# Altium project DCDC.PrjPcb (part 4 of 9)

## Sheet ISO_IO.SchDoc
size A3 portrait; SheetNumber: 3; SheetTotal: 8
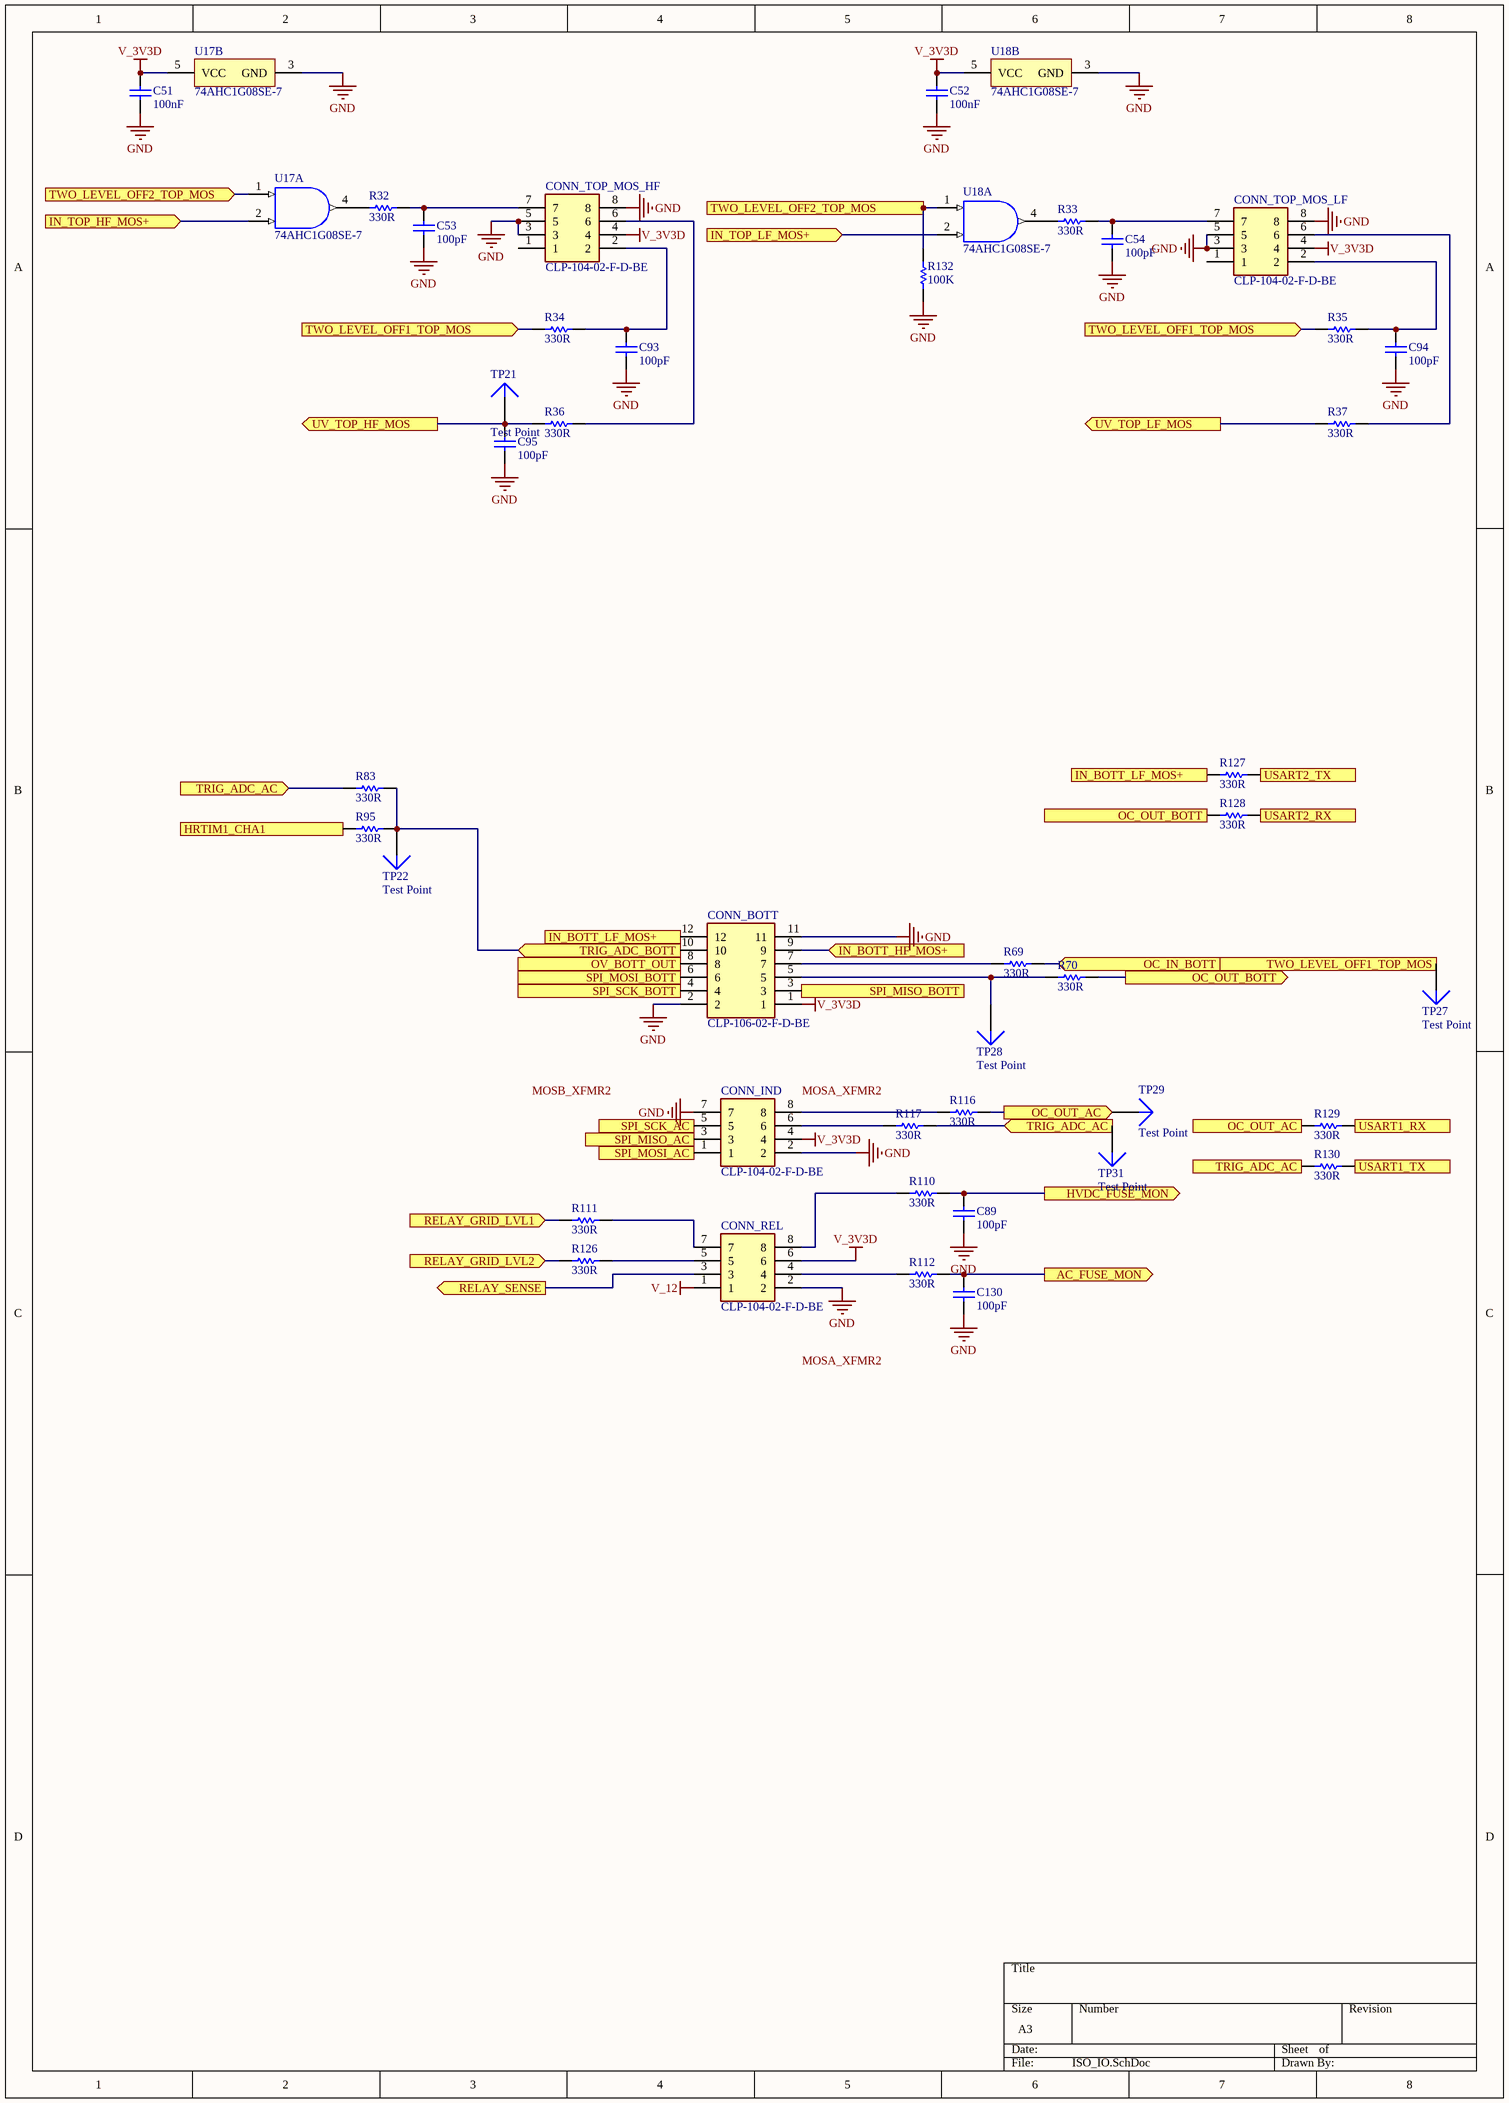
[diagram p3: ISO_IO.SchDoc]

### Parts
C51  100nF  [CAPC1608X90X35NL10T15]
C52  100nF  [CAPC1608X90X35NL10T15]
C53  100pF  [CAPC1608X90X35NL10T15]
C54  100pF  [CAPC1608X90X35NL10T15]
C89  100pF  [CAPC1608X90X35NL10T15]
C93  100pF  [CAPC1608X90X35NL10T15]
C94  100pF  [CAPC1608X90X35NL10T15]
C95  100pF  [CAPC1608X90X35NL10T15]
C130  100pF  [CAPC1608X90X35NL10T15]
CONN_BOTT  CLP-106-02-F-D-BE  [CLP-106-02-XXX-D-BE]
CONN_IND  CLP-104-02-F-D-BE  [CLP-104-02-XXX-D-BE]
CONN_REL  CLP-104-02-F-D-BE  [CLP-104-02-XXX-D-BE]
CONN_TOP_MOS_HF  CLP-104-02-F-D-BE  [CLP-104-02-XXX-D-BE]
CONN_TOP_MOS_LF  CLP-104-02-F-D-BE  [CLP-104-02-XXX-D-BE]
R32  330R  [RESC1608X55X25NL10T15]
R33  330R  [RESC1608X55X25NL10T15]
R34  330R  [RESC1608X55X25NL10T15]
R35  330R  [RESC1608X55X25NL10T15]
R36  330R  [RESC1608X55X25NL10T15]
R37  330R  [RESC1608X55X25NL10T15]
R69  330R  [RESC1608X55X25NL10T15]
R70  330R  [RESC1608X55X25NL10T15]
R83  330R  [RESC1608X55X25NL10T15]
R95  330R  [RESC1608X55X25NL10T15]
R110  330R  [RESC1608X55X25NL10T15]
R111  330R  [RESC1608X55X25NL10T15]
R112  330R  [RESC1608X55X25NL10T15]
R116  330R  [RESC1608X55X25NL10T15]
R117  330R  [RESC1608X55X25NL10T15]
R126  330R  [RESC1608X55X25NL10T15]
R127  330R  [RESC1608X55X25NL10T15]
R128  330R  [RESC1608X55X25NL10T15]
R129  330R  [RESC1608X55X25NL10T15]
R130  330R  [RESC1608X55X25NL10T15]
R132  100K  [RESC1608X55X25NL10T15]
TP21  Test Point  [TP1.5mm]
TP22  Test Point  [TP1.5mm]
TP27  Test Point  [TP1.5mm]
TP28  Test Point  [TP1.5mm]
TP29  Test Point  [TP1.5mm]
TP31  Test Point  [TP1.5mm]
U17  74AHC1G08SE-7  [DCK0005A_M]  (parts A,B of 2)
U18  74AHC1G08SE-7  [DCK0005A_M]  (parts A,B of 2)

### Ports
AC_FUSE_MON (out), HRTIM1_CHA1 (in), HVDC_FUSE_MON (out), IN_BOTT_HF_MOS+ (in), IN_BOTT_LF_MOS+ (in), IN_BOTT_LF_MOS+ (out), IN_TOP_HF_MOS+ (in), IN_TOP_LF_MOS+ (in), OC_IN_BOTT (in), OC_OUT_AC (in), OC_OUT_AC (out), OC_OUT_BOTT (in), OC_OUT_BOTT (out), OV_BOTT_OUT (out), RELAY_GRID_LVL1 (in), RELAY_GRID_LVL2 (in), RELAY_SENSE (out), SPI_MISO_AC (in), SPI_MISO_BOTT (in), SPI_MOSI_AC (out), SPI_MOSI_BOTT (out), SPI_SCK_AC (out), SPI_SCK_BOTT (out), TRIG_ADC_AC (in), TRIG_ADC_AC (out), TRIG_ADC_BOTT (in), TWO_LEVEL_OFF1_TOP_MOS (in), TWO_LEVEL_OFF1_TOP_MOS (out), TWO_LEVEL_OFF2_TOP_MOS (in), USART1_RX (out), USART1_TX (in), USART2_RX (out), USART2_TX (in), UV_TOP_HF_MOS (out), UV_TOP_LF_MOS (out)

### Nets
GND: C51.1 C52.1 C53.1 C54.1 C89.1 C93.1 C94.1 C95.1 C130.1 CONN_BOTT.2 CONN_BOTT.11 CONN_IND.2 CONN_IND.7 CONN_REL.2 CONN_TOP_MOS_HF.3 CONN_TOP_MOS_HF.5 CONN_TOP_MOS_HF.8 CONN_TOP_MOS_LF.3 CONN_TOP_MOS_LF.5 CONN_TOP_MOS_LF.8 R132.1 U17.3(GND) U18.3(GND)
V_3V3D: C51.2 C52.2 CONN_BOTT.1 CONN_IND.4 CONN_REL.6 CONN_TOP_MOS_HF.4 CONN_TOP_MOS_LF.4 U17.5(VCC) U18.5(VCC)
V_12: CONN_REL.1
HRTIM1_CHA1: R95.1 ; port HRTIM1_CHA1
HRTIM1_CHE2: R83.1 R117.2 R130.1 TP31.1 ; port TRIG_ADC_AC
HRTIM1_CHF1: U17.2(B) ; port IN_TOP_HF_MOS+
HRTIM1_CHF2: CONN_BOTT.9 ; port IN_BOTT_HF_MOS+
USART2_RX_STM32: R128.2 ; port USART2_RX
USART2_TX_STM32: R127.2 ; port USART2_TX
NetC53_2: C53.2 CONN_TOP_MOS_HF.7 R32.2
NetC54_2: C54.2 CONN_TOP_MOS_LF.7 R33.2
NetC89_2: C89.2 R110.1 ; port HVDC_FUSE_MON
NetC93_2: C93.2 CONN_TOP_MOS_HF.2 R34.2
NetC94_2: C94.2 CONN_TOP_MOS_LF.2 R35.2
NetC95_2: C95.2 R36.1 R37.1 TP21.1 ; port UV_TOP_LF_MOS, port UV_TOP_HF_MOS
NetC130_2: C130.2 R112.1 ; port AC_FUSE_MON
NetCONN_BOTT_3: CONN_BOTT.3 ; port SPI_MISO_BOTT
NetCONN_BOTT_4: CONN_BOTT.4 ; port SPI_SCK_BOTT
NetCONN_BOTT_5: CONN_BOTT.5 R70.1 TP28.1
NetCONN_BOTT_6: CONN_BOTT.6 ; port SPI_MOSI_BOTT
NetCONN_BOTT_7: CONN_BOTT.7 R69.1
NetCONN_BOTT_8: CONN_BOTT.8 ; port OV_BOTT_OUT
NetCONN_BOTT_10: CONN_BOTT.10 R83.2 R95.2 TP22.1 ; port TRIG_ADC_BOTT
NetCONN_BOTT_12: CONN_BOTT.12 R127.1 ; port IN_BOTT_LF_MOS+
NetCONN_IND_1: CONN_IND.1 ; port SPI_MOSI_AC
NetCONN_IND_3: CONN_IND.3 ; port SPI_MISO_AC
NetCONN_IND_5: CONN_IND.5 ; port SPI_SCK_AC
NetCONN_IND_6: CONN_IND.6 R117.1
NetCONN_IND_8: CONN_IND.8 R116.1
NetCONN_REL_3: CONN_REL.3 ; port RELAY_SENSE
NetCONN_REL_4: CONN_REL.4 R112.2
NetCONN_REL_5: CONN_REL.5 R126.2
NetCONN_REL_7: CONN_REL.7 R111.1
NetCONN_REL_8: CONN_REL.8 R110.2
NetCONN_TOP_MOS_HF_6: CONN_TOP_MOS_HF.6 R36.2
NetCONN_TOP_MOS_LF_6: CONN_TOP_MOS_LF.6 R37.2
NetR32_1: R32.1 U17.4(Y)
NetR33_1: R33.1 U18.4(Y)
NetR34_1: R34.1 R35.1 R69.2 TP27.1 ; port TWO_LEVEL_OFF1_TOP_MOS, port OC_IN_BOTT
NetR70_2: R70.2 R128.1 ; port OC_OUT_BOTT
NetR111_2: R111.2 ; port RELAY_GRID_LVL1
NetR116_2: R116.2 R129.1 TP29.1 ; port OC_OUT_AC
NetR125_1: R132.2 U17.1(A) U18.1(A) ; port TWO_LEVEL_OFF2_TOP_MOS
NetR126_1: R126.1 ; port RELAY_GRID_LVL2
NetR129_2: R129.2 ; port USART1_RX
NetR130_2: R130.2 ; port USART1_TX
NetU1_2: U18.2(B) ; port IN_TOP_LF_MOS+

Not connected (* = marked no-connect by the designer): CONN_TOP_MOS_HF 1; CONN_TOP_MOS_LF 1

### Notes on the sheet
- Labels drawn without touching a wire or pin: MOSA_XFMR2, MOSB_XFMR2

### Library data of the parts
C51 C52 = CAP: X7R 100nF ±10% 50V 0603 Multilayer Ceramic Capacitors MLCC - SMD/SMT ROHS; Part Number: GCM188R72A104KA64D; Manufacturer: Murata; Manufacturer Part Number: CC0603KRX7R9BB104; Voltage Rating: 100V; Supplier 1: Arrow Electronics; Supplier Part Number 1: GCM188R72A104KA64D; RoHS: Yes; Category: Ceramic Capacitors; Mount: Surface Mount; Case/Package: 0603; Case Code (Imperial): 0603; Case Code (Metric): 1608; Min Operating Temperature: -55°C; Max Operating Temperature: 125°C; Tolerance: 10%; Packaging: Tape and Reel; Capacitance: 100nF; Dielectric: X7R; Termination: SMD/SMT; Voltage Rating (DC): 100V; Length: 1.6mm; Height: 0.8mm; Depth: 0.8mm; Radiation Hardening: No; ComponentLink1URL: https://datasheet.ciiva.com/17451/product-17451047.pdf?src-supplier=Avnet+Europe; ComponentLink1Description: https://datasheet.ciiva.com/17451/product-17451047.pdf?src-supplier=Avnet+Europe; ComponentLink2URL: https://datasheet.ciiva.com/26889/getdatasheetpartid-387765-26889164.pdf?src-supplier=Verical; ComponentLink2Description: https://datasheet.ciiva.com/26889/getdatasheetpartid-387765-26889164.pdf?src-supplier=Verical; Parameter 1: *; JLCPCB Part #: C14663
C53 C54 C89 C93-C95 C130 = CMP-2006-02595-1: C0G ±5% 50V 100pF 0603 Multilayer Ceramic Capacitors MLCC - SMD/SMT ROHS; Part Number: GRM1885C1H101JA01D; Manufacturer: Murata; Temperature Coefficient: 30ppm/°C; Insulation Resistance: 10GR; Supplier 1: Digi-Key; Supplier Part Number 1: 490-1427-1-ND; Manufacturer Part Number: GRM1885C1H101JA01D; RoHS: Yes; Category: Ceramic Capacitors; Stock 1: 98306; Pricing 1: 1=0.10000, 10=0.06100, 50=0.03320, 100=0.02700, 500=0.01932, 1000=0.01518 (USD); Mount: Surface Mount; Case/Package: 0603; Number of Pins: 2; Case Code (Metric): 1608; Case Code (Imperial): 0603; Dielectric Material: Ceramic; Weight: 7.1E-05oz; Material: Ceramic; Min Operating Temperature: -55°C; Max Operating Temperature: 125°C; Capacitance: 100pF; Voltage Rating: 50V; Tolerance: 5%; Packaging: Tape and Reel; Package Quantity: 1; Voltage Rating (DC): 50V; Dielectric: C0G; Termination: SMD/SMT; Voltage: 50V; Length: 1.6mm; Width: 0.031inch; Height: 0.8mm; Thickness: 0.035inch; Depth: 0.8mm; Radiation Hardening: No; RoHS Compliant: Yes; REACH SVHC: Unknown; Lead Free: Lead Free; ComponentLink1URL: https://datasheet.ciiva.com/131/product-131088.pdf?src-supplier=Digi-Key; ComponentLink1Description: https://datasheet.ciiva.com/131/product-131088.pdf?src-supplier=Digi-Key; ComponentLink2URL: https://datasheet.ciiva.com/18100/getdatasheetpartid-26823-18100641.pdf?src-supplier=Verical; ComponentLink2Description: https://datasheet.ciiva.com/18100/getdatasheetpartid-26823-18100641.pdf?src-supplier=Verical; ComponentLink3URL: https://datasheet.ciiva.com/3777/grm1885c1h101ja0123-3777264.pdf?src-supplier=Arrow+Electronics; ComponentLink3Description: https://datasheet.ciiva.com/3777/grm1885c1h101ja0123-3777264.pdf?src-supplier=Arrow+Electronics; ComponentLink4URL: https://datasheet.ciiva.com/29149/450134-da-01-en-vs-kondensator-0603-29149008.pdf?src-supplier=Conrad; ComponentLink4Description: https://datasheet.ciiva.com/29149/450134-da-01-en-vs-kondensator-0603-29149008.pdf?src-supplier=Conrad; ComponentLink5URL: https://datasheet.ciiva.com/131/partnumbering-e-01-131089.pdf?src-supplier=Digi-Key; ComponentLink5Description: https://datasheet.ciiva.com/131/partnumbering-e-01-131089.pdf?src-supplier=Digi-Key; ComponentLink6URL: https://datasheet.ciiva.com/11605/c02e-11605557.pdf?src-supplier=Avnet; ComponentLink6Description: https://datasheet.ciiva.com/11605/c02e-11605557.pdf?src-supplier=Avnet; ComponentLink7URL: https://datasheet.ciiva.com/28556/4360-28556551.pdf?src-supplier=Element14; ComponentLink7Description: https://datasheet.ciiva.com/28556/4360-28556551.pdf?src-supplier=Element14; ComponentLink8URL: https://datasheet.ciiva.com/7828/4360-7828889.pdf?src-supplier=Element14; ComponentLink8Description: https://datasheet.ciiva.com/7828/4360-7828889.pdf?src-supplier=Element14; ComponentLink9URL: https://datasheet.ciiva.com/7828/4360-7828890.pdf?src-supplier=Element14; ComponentLink9Description: https://datasheet.ciiva.com/7828/4360-7828890.pdf?src-supplier=Element14; ComponentLink10URL: https://datasheet.ciiva.com/7828/4360-7828891.pdf?src-supplier=Element14; ComponentLink10Description: https://datasheet.ciiva.com/7828/4360-7828891.pdf?src-supplier=Element14; ComponentLink11URL: https://datasheet.ciiva.com/14116/grmseries-tc-hitype-eng-14116828.pdf?src-supplier=Distrelec; ComponentLink11Description: https://datasheet.ciiva.com/14116/grmseries-tc-hitype-eng-14116828.pdf?src-supplier=Distrelec; ComponentLink12URL: https://datasheet.ciiva.com/16291/product-16291613.pdf?src-supplier=Future+Electronics; ComponentLink12Description: https://datasheet.ciiva.com/16291/product-16291613.pdf?src-supplier=Future+Electronics; ComponentLink13URL: https://datasheet.ciiva.com/131/partnumbering-e-01-131087.pdf?src-supplier=Digi-Key; ComponentLink13Description: https://datasheet.ciiva.com/131/partnumbering-e-01-131087.pdf?src-supplier=Digi-Key; ComponentLink14URL: https://datasheet.ciiva.com/14116/grmseries-tc-hitype-eng-14116815.pdf?src-supplier=Distrelec; ComponentLink14Description: https://datasheet.ciiva.com/14116/grmseries-tc-hitype-eng-14116815.pdf?src-supplier=Distrelec; Parameter 1: *; JLCPCB Part #: C14858
CONN_BOTT = CLP-106-02-F-D-BE: Connector; Manufacturer_Name: SAMTEC; Datasheet Link: http://suddendocs.samtec.com/prints/erm8-xxx-xx.x-xxx-dv-xxxx-xx-mkt.pdf; Manufacturer_Part_Number: CLP-106-02-F-D-BE; Mouser Part Number: 200-CLP10602FDBE; Mouser Price/Stock: https://www.mouser.co.uk/ProductDetail/Samtec/CLP-106-02-F-D-BE?qs=0lQeLiL1qybMRsXYGL6Lww%3D%3D; Arrow Part Number: CLP-106-02-F-D-BE; Arrow Price/Stock: https://www.arrow.com/en/products/clp-106-02-f-d-be/samtec; Parameter 1: *; JLCPCB Part #: *
CONN_IND CONN_REL CONN_TOP_MOS_HF CONN_TOP_MOS_LF = CLP-104-02-F-D-BE: Connector; Manufacturer_Name: SAMTEC; Datasheet Link: http://suddendocs.samtec.com/prints/erm8-xxx-xx.x-xxx-dv-xxxx-xx-mkt.pdf; Manufacturer_Part_Number: CLP-104-02-F-D-BE; Mouser Part Number: 200-CLP10402FDBE; Mouser Price/Stock: https://www.mouser.co.uk/ProductDetail/Samtec/CLP-104-02-F-D-BE?qs=0lQeLiL1qybJIh6Z%2F3PMbA%3D%3D; Arrow Part Number: CLP-104-02-F-D-BE; Arrow Price/Stock: https://www.arrow.com/en/products/clp-104-02-f-d-be/samtec; Parameter 1: *; JLCPCB Part #: *
R32-R37 = RES-2: ±1% 330Ω ±100ppm/℃ 0.1W 0603 Chip Resistor - Surface Mount ROHS; Tolerance: 10%; ESR: 800 mohm; Voltage Rating (DC): 16 V; Capacitance: 47 uF; Length: 7.3 mm; ComponentLink1URL: http://www.yageo.com/; Packaging: Tape and Reel; Pins: 2; ComponentLink1Description: Manufacturer URL; Case Code (Imperial): 2917; REACH SVHC: No SVHC; Width: 4.3 mm; ComponentLink2Description: Datasheet; Voltage Rating: 16 V; RoHSCompliant: True; Max Operating Temperature: 125degC; ComponentLink2URL: http://www.yageo.com/documents/recent/PYu-RC_Group_51_RoHS_L_04.pdf; Min Operating Temperature: -55degC; Case/Package: 2917; Radiation Hardening: No; DatasheetVersion: Rev. 4, 02/2016; Mount: Surface Mount; PackageReference: 0603; Package Quantity: 500; Case Code (Metric): 7343; PackageDescription: 2-Pin Surface Mount Device, Body 1.6 x 0.8 mm; Height: 3.1 mm; Parameter 1: *; JLCPCB Part #: C23138
R69 R70 R83 R95 R116 R117 R126-R130 = CMP-1659-00020-2: ±1% 330Ω ±100ppm/℃ 0.1W 0603 Chip Resistor - Surface Mount ROHS; Manufacturer: Yageo; Manufacturer Part Number: RC0603FR-07330RL; Tolerance: 10%; ESR: 800 mohm; Voltage Rating (DC): 16 V; Capacitance: 47 uF; Temperature Coefficient: 100ppm/°C; Power Rating: 100mW; Length: 7.3 mm; ComponentLink1URL: http://www.yageo.com/; Packaging: Tape and Reel; Pins: 2; ComponentLink1Description: Manufacturer URL; Case Code (Imperial): 2917; REACH SVHC: No SVHC; Width: 4.3 mm; ComponentLink2Description: Datasheet; Voltage Rating: 16 V; RoHSCompliant: True; Max Operating Temperature: 125degC; ComponentLink2URL: http://www.yageo.com/documents/recent/PYu-RC_Group_51_RoHS_L_04.pdf; Min Operating Temperature: -55degC; Case/Package: 2917; Radiation Hardening: No; DatasheetVersion: Rev. 4, 02/2016; Mount: Surface Mount; PackageReference: 0603; Package Quantity: 500; Case Code (Metric): 7343; PackageDescription: 2-Pin Surface Mount Device, Body 1.6 x 0.8 mm; Height: 3.1 mm; Supplier 1: Digi-Key; Supplier Part Number 1: 311-330HRCT-ND; RoHS: Yes; Category: Chip SMD Resistors; Stock 1: 4209654; Pricing 1: 1=0.10000, 10=0.02300, 100=0.00940, 1000=0.00421, 2500=0.00366 (USD); Number of Pins: 2; Composition: Thick Film; Resistance: 330R; Number of Terminations: 2; Max Power Dissipation: 100mW; Termination: SMD/SMT; Features: Moisture Resistant; Depth: 0.8mm; Lead Free: Lead Free; ComponentLink3URL: https://datasheet.ciiva.com/11819/0900766b80f96399-11819327.pdf?src-supplier=RSComponents; ComponentLink3Description: https://datasheet.ciiva.com/11819/0900766b80f96399-11819327.pdf?src-supplier=RSComponents; ComponentLink4URL: https://datasheet.ciiva.com/2454/pyu-r-int-thick-7-2454864.pdf?src-supplier=Digi-Key; ComponentLink4Description: https://datasheet.ciiva.com/2454/pyu-r-int-thick-7-2454864.pdf?src-supplier=Digi-Key; ComponentLink5URL: https://datasheet.ciiva.com/2454/pyu-r-int-thick-7-2454865.pdf?src-supplier=Digi-Key; ComponentLink5Description: https://datasheet.ciiva.com/2454/pyu-r-int-thick-7-2454865.pdf?src-supplier=Digi-Key; ComponentLink6URL: https://datasheet.ciiva.com/2454/pyu-r-int-thick-7-2454866.pdf?src-supplier=Digi-Key; ComponentLink6Description: https://datasheet.ciiva.com/2454/pyu-r-int-thick-7-2454866.pdf?src-supplier=Digi-Key; ComponentLink7URL: https://datasheet.ciiva.com/12555/rc0603-272842-12555334.pdf?src-supplier=Mouser; ComponentLink7Description: https://datasheet.ciiva.com/12555/rc0603-272842-12555334.pdf?src-supplier=Mouser; ComponentLink8URL: https://datasheet.ciiva.com/46440/1868787-46440904.pdf?src-supplier=Element14; ComponentLink8Description: https://datasheet.ciiva.com/46440/1868787-46440904.pdf?src-supplier=Element14; ComponentLink9URL: https://datasheet.ciiva.com/7746/443971-7746329.pdf?src-supplier=Element14; ComponentLink9Description: https://datasheet.ciiva.com/7746/443971-7746329.pdf?src-supplier=Element14; ComponentLink10URL: https://datasheet.ciiva.com/7746/443971-7746330.pdf?src-supplier=Element14; ComponentLink10Description: https://datasheet.ciiva.com/7746/443971-7746330.pdf?src-supplier=Element14; ComponentLink11URL: https://datasheet.ciiva.com/7746/1686128-7746331.pdf?src-supplier=Element14; ComponentLink11Description: https://datasheet.ciiva.com/7746/1686128-7746331.pdf?src-supplier=Element14; Parameter 1: *; JLCPCB Part #: C23138
R110-R112 = RES-2: ±1% 330Ω ±100ppm/℃ 0.1W 0603 Chip Resistor - Surface Mount ROHS; Manufacturer: Yageo; Manufacturer Part Number: RC0603FR-07330RL; Tolerance: 10%; ESR: 800 mohm; Voltage Rating (DC): 16 V; Capacitance: 47 uF; Temperature Coefficient: 100ppm/°C; Power Rating: 100mW; Length: 7.3 mm; ComponentLink1URL: http://www.yageo.com/; Packaging: Tape and Reel; Pins: 2; ComponentLink1Description: Manufacturer URL; Case Code (Imperial): 2917; REACH SVHC: No SVHC; Width: 4.3 mm; ComponentLink2Description: Datasheet; Voltage Rating: 16 V; RoHSCompliant: True; Max Operating Temperature: 125degC; ComponentLink2URL: http://www.yageo.com/documents/recent/PYu-RC_Group_51_RoHS_L_04.pdf; Min Operating Temperature: -55degC; Case/Package: 2917; Radiation Hardening: No; DatasheetVersion: Rev. 4, 02/2016; Mount: Surface Mount; PackageReference: 0603; Package Quantity: 500; Case Code (Metric): 7343; PackageDescription: 2-Pin Surface Mount Device, Body 1.6 x 0.8 mm; Height: 3.1 mm; Supplier 1: Digi-Key; Supplier Part Number 1: 311-330HRCT-ND; RoHS: Yes; Category: Chip SMD Resistors; Stock 1: 4209654; Pricing 1: 1=0.10000, 10=0.02300, 100=0.00940, 1000=0.00421, 2500=0.00366 (USD); Number of Pins: 2; Composition: Thick Film; Resistance: 330R; Number of Terminations: 2; Max Power Dissipation: 100mW; Termination: SMD/SMT; Features: Moisture Resistant; Depth: 0.8mm; Lead Free: Lead Free; ComponentLink3URL: https://datasheet.ciiva.com/11819/0900766b80f96399-11819327.pdf?src-supplier=RSComponents; ComponentLink3Description: https://datasheet.ciiva.com/11819/0900766b80f96399-11819327.pdf?src-supplier=RSComponents; ComponentLink4URL: https://datasheet.ciiva.com/2454/pyu-r-int-thick-7-2454864.pdf?src-supplier=Digi-Key; ComponentLink4Description: https://datasheet.ciiva.com/2454/pyu-r-int-thick-7-2454864.pdf?src-supplier=Digi-Key; ComponentLink5URL: https://datasheet.ciiva.com/2454/pyu-r-int-thick-7-2454865.pdf?src-supplier=Digi-Key; ComponentLink5Description: https://datasheet.ciiva.com/2454/pyu-r-int-thick-7-2454865.pdf?src-supplier=Digi-Key; ComponentLink6URL: https://datasheet.ciiva.com/2454/pyu-r-int-thick-7-2454866.pdf?src-supplier=Digi-Key; ComponentLink6Description: https://datasheet.ciiva.com/2454/pyu-r-int-thick-7-2454866.pdf?src-supplier=Digi-Key; ComponentLink7URL: https://datasheet.ciiva.com/12555/rc0603-272842-12555334.pdf?src-supplier=Mouser; ComponentLink7Description: https://datasheet.ciiva.com/12555/rc0603-272842-12555334.pdf?src-supplier=Mouser; ComponentLink8URL: https://datasheet.ciiva.com/46440/1868787-46440904.pdf?src-supplier=Element14; ComponentLink8Description: https://datasheet.ciiva.com/46440/1868787-46440904.pdf?src-supplier=Element14; ComponentLink9URL: https://datasheet.ciiva.com/7746/443971-7746329.pdf?src-supplier=Element14; ComponentLink9Description: https://datasheet.ciiva.com/7746/443971-7746329.pdf?src-supplier=Element14; ComponentLink10URL: https://datasheet.ciiva.com/7746/443971-7746330.pdf?src-supplier=Element14; ComponentLink10Description: https://datasheet.ciiva.com/7746/443971-7746330.pdf?src-supplier=Element14; ComponentLink11URL: https://datasheet.ciiva.com/7746/1686128-7746331.pdf?src-supplier=Element14; ComponentLink11Description: https://datasheet.ciiva.com/7746/1686128-7746331.pdf?src-supplier=Element14; Parameter 1: *; JLCPCB Part #: C23138
R132 = CMP-2100-03662-1: ±1% 100kΩ ±100ppm/℃ 0.1W 0603 Chip Resistor - Surface Mount ROHS; Manufacturer: Yageo; Manufacturer Part Number: RC0603FR-07100KL; Power Rating: 100mW; Voltage Rating: 50V; Resistance: 100KOhm; Temperature Coefficient: 100ppm/degreesC; Working Voltage: 75V; Datasheet Version: Rev. 5, 10/2016; Height: 0.45mm; Lead Free: LeadFree; Manufacturer URL: http://www.yageo.com/; Package Reference: 0603; Depth: 0.8mm; RoHSCompliant: true; Composition: ThickFilm; Military Standard: Not; Case/Package: 0603; Packaging: TapeandReel; Case Code (Imperial): 0603; Voltage Rating (DC): 50V; Case Code (Metric): 1608; Tolerance: 1%; Termination: SMD/SMT; Min Operating Temperature: -55degC; Number of Pins: 2; Length: 1.6mm; Width: 0.8mm; Datasheet URL: http://www.yageo.com/NewPortal/yageodocoutput?fileName=/pdf/R-Chip/PYu-RC_Group_51_RoHS_L_5.pdf; Package Description: 2-Pin Surface Mount Device, Body 1.6 x 0.8 mm; Max Operating Temperature: 155degC; REACH SVHC: NoSVHC; Supplier 1: Digi-Key; Supplier Part Number 1: 311-100KHRCT-ND; RoHS: Yes; Category: Chip SMD Resistors; Stock 1: 19283456; Pricing 1: 1=0.10000, 10=0.02400, 100=0.00970, 1000=0.00436, 2500=0.00378 (USD); Series: RC; Max Power Dissipation: 100mW; Resistor Type: Thick Film; Number of Terminations: 2; Resistance Tolerance: 1%; Features: Moisture Resistant; Construction: Rectangular; Technology: THICK FILM; RoHS Compliant: Yes; ComponentLink1URL: https://datasheet.ciiva.com/11808/0900766b80f96399-11808107.pdf?src-supplier=RSComponents; ComponentLink1Description: https://datasheet.ciiva.com/11808/0900766b80f96399-11808107.pdf?src-supplier=RSComponents; ComponentLink2URL: https://datasheet.ciiva.com/7983/443971-7983593.pdf?src-supplier=Element14; ComponentLink2Description: https://datasheet.ciiva.com/7983/443971-7983593.pdf?src-supplier=Element14; ComponentLink3URL: https://datasheet.ciiva.com/46440/1868787-46440889.pdf?src-supplier=Element14; ComponentLink3Description: https://datasheet.ciiva.com/46440/1868787-46440889.pdf?src-supplier=Element14; ComponentLink4URL: https://datasheet.ciiva.com/7746/1738695-7746234.pdf?src-supplier=Element14; ComponentLink4Description: https://datasheet.ciiva.com/7746/1738695-7746234.pdf?src-supplier=Element14; ComponentLink5URL: https://datasheet.ciiva.com/7746/1738695-7746235.pdf?src-supplier=Element14; ComponentLink5Description: https://datasheet.ciiva.com/7746/1738695-7746235.pdf?src-supplier=Element14; ComponentLink6URL: https://datasheet.ciiva.com/22747/443971-22747516.pdf?src-supplier=Element14; ComponentLink6Description: https://datasheet.ciiva.com/22747/443971-22747516.pdf?src-supplier=Element14; Parameter 1: *; JLCPCB Part #: C25803
TP21 TP22 TP27-TP29 TP31 = Test_Point 1.5mm round: Round Test Point; LatestRevisionDate: 17-Jul-2002; LatestRevisionNote: Re-released for DXP Platform.; Publisher: Altium Limited; Parameter 1: *; JLCPCB Part #: *
U17 U18 = CMP-0859-00394-3: Single 2-Input Positive-AND Gate, DCK0005A, SMALL T&R; Generic Part Number: SN74AHC1G08; Manufacturer: Texas Instruments; Schmitt Trigger: No; ICC @ Nom Voltage(Max)(mA): 0.01; Technology Family: AHC; Output Drive (IOL/IOH)(Max)(mA): 50/-50; tpd @ Nom Voltage(Max)(ns): 12.3,7.9; Logic: True; Gate Type: AND; VCC(Min)(V): 2; Input Type: CMOS; Voltage(Nom)(V): 3.3,5; Bits(#): 1; VCC(Max)(V): 5.5; F @ Nom Voltage(Max)(Mhz): 75; Rating: Catalog; 3-State Output: No; Operating Temperature Range(C): -55 to 125; DatasheetVersion: SCLS314N; Sub-Family: AND Gate; Output Type: CMOS; PackageReference: DCK0005A; Parameter 1: *; JLCPCB Part #: *

## Sheet ISO_Power.SchDoc
size A3; SheetNumber: 4; SheetTotal: 8
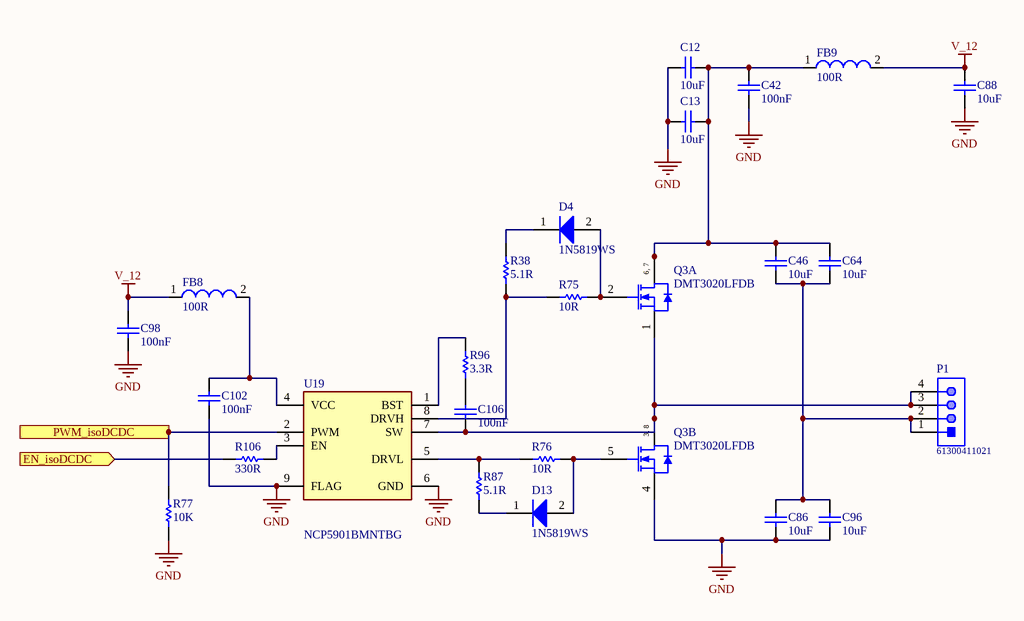
[diagram p4: ISO_Power.SchDoc]

### Parts
C12  10uF  [CAPC2013X140X45NL15T25]
C13  10uF  [CAPC2013X140X45NL15T25]
C42  100nF  [CAPC1608X90X35NL10T15]
C46  10uF  [CAPC2013X140X45NL15T25]
C64  10uF  [CAPC2013X140X45NL15T25]
C86  10uF  [CAPC2013X140X45NL15T25]
C88  10uF  [CAPC2013X140X45NL15T25]
C96  10uF  [CAPC2013X140X45NL15T25]
C98  100nF  [CAPC1608X90X35NL10T15]
C102  100nF  [CAPC1608X90X35NL10T15]
C106  100nF  [CAPC1608X90X35NL10T15]
D4  1N5819WS  [ONSC-SOD-323-2-477-02_V]
D13  1N5819WS  [ONSC-SOD-323-2-477-02_V]
FB8  100R  [SMD-0603]
FB9  100R  [SMD-0603]
P1  61300411021  [61300411021]
Q3  DMT3020LFDB  [NXP-SOT1118_L]  (parts A,B of 2)
R38  5.1R  [RESC1608X55X30NL15T15]
R75  10R  [RESC1608X55X25NL10T15]
R76  10R  [RESC1608X55X25NL10T15]
R77  10K  [RESC1608X55X25NL10T15]
R87  5.1R  [RESC1608X55X30NL15T15]
R96  3.3R  [RESC1608X55X30NL15T15]
R106  330R  [RESC1608X55X25NL10T15]
U19  NCP5901BMNTBG  [SON50P200X200X100-9N]

### Ports
EN_isoDCDC (in), PWM_isoDCDC (in)

### Nets
GND: C12.2 C13.2 C42.1 C86.2 C88.2 C96.2 C98.1 C102.1 Q3.4(S2) R77.1 U19.6(GND) U19.9(FLAG)
V_12: C88.1 C98.2 FB8.1 FB9.2
NetC12_1: C12.1 C13.1 C42.2 C46.1 C64.1 FB9.1 Q3.6(D1) Q3.7(D1)
NetC46_2: C46.2 C64.2 C86.1 C96.1 P1.1 P1.2
NetC102_2: C102.2 FB8.2 U19.4(VCC)
NetC106_1: C106.1 P1.3 P1.4 Q3.1(S1) Q3.3(D2) Q3.8(D2) U19.7(SW)
NetC106_2: C106.2 R96.1
NetD4_1: D4.1(K) R38.2
NetD4_2: D4.2(A) Q3.2(G1) R75.2
NetD13_1: D13.1(K) R87.1
NetD13_2: D13.2(A) Q3.5(G2) R76.2
NetR38_1: R38.1 R75.1 U19.8(DRVH)
NetR76_1: R76.1 R87.2 U19.5(DRVL)
NetR77_2: R77.2 U19.2(PWM) ; port PWM_isoDCDC
NetR96_2: R96.2 U19.1(BST)
NetR106_1: R106.1 U19.3(EN)
NetR106_2: R106.2 ; port EN_isoDCDC

### Notes on the sheet
- (in symbol CMP-1258-00008-1, part A) 6, 7
- (in symbol CMP-1258-00008-1, part B) 3, 8

### Library data of the parts
C12 C13 C46 C64 C86 C88 C96 = CMP-2007-03395-1: X5R 25V ±10% 10uF 0805 Multilayer Ceramic Capacitors MLCC - SMD/SMT ROHS; Part Number: GRM21BR71A106KE51L; Manufacturer: Murata; Parameter 1: *; JLCPCB Part #: C15850
C42 C98 C102 C106 = CAP: as C51 on sheet ISO_IO; Supplier 1: Arrow Electronics; Supplier Part Number 1: GCM188R72A104KA64D; RoHS: Yes; Category: Ceramic Capacitors; Mount: Surface Mount; Case/Package: 0603; Case Code (Imperial): 0603; Case Code (Metric): 1608; Min Operating Temperature: -55°C; Max Operating Temperature: 125°C; Tolerance: 10%; Packaging: Tape and Reel; Capacitance: 100nF; Dielectric: X7R; Termination: SMD/SMT; Voltage Rating (DC): 100V; Length: 1.6mm; Height: 0.8mm; Depth: 0.8mm; Radiation Hardening: No; ComponentLink1URL: https://datasheet.ciiva.com/17451/product-17451047.pdf?src-supplier=Avnet+Europe; ComponentLink1Description: https://datasheet.ciiva.com/17451/product-17451047.pdf?src-supplier=Avnet+Europe; ComponentLink2URL: https://datasheet.ciiva.com/26889/getdatasheetpartid-387765-26889164.pdf?src-supplier=Verical; ComponentLink2Description: https://datasheet.ciiva.com/26889/getdatasheetpartid-387765-26889164.pdf?src-supplier=Verical; Parameter 1: *; JLCPCB Part #: C14663
D4 D13 = CMP-1055-00462-1: 40V 1A 600mV @ 1A SOD-323 Schottky Barrier Diodes (SBD) ROHS; PartNumber: BAT54HT1G; Manufacturer: On Semiconductor; Configuration: Single; trr Max (ns): 5; Packing: Tape and Reel; IFSM Max (A): 0.6; ComponentLink3URL: http://www.onsemi.com/pub_link/Collateral/477-02.PDF.1; PackageDescription: 2-Pin SOD, Body 1.7 x 1.25 mm; ComponentLink2URL: http://www.onsemi.cn/pub_link/Collateral/BAT54HT1-D.PDF; ComponentLink3Description: Package Specification; ComponentLink2Description: Datasheet; DatasheetVersion: Rev. 6; PackageReference: SOD-323-2-477-02; RoHS: TRUE; ComponentLink1URL: http://www.onsemi.com/; Mounting Technology: Surface Mount; ComponentLink1Description: Manufacturer URL; PackageVersion: Rev. H, 03/2007; Parameter 1: *; JLCPCB Part #: C191023
FB8 = CMP-0220-00115-1: SMD EMI Suppression Ferrite Bead WE-CBF, Z = 1500 Ohm; DatasheetVersion: Dec-2005; ComponentLink1URL: http://www.we-online.com; PackageVersion: 2009; PackageDescription: Chip Inductor, 2-Leads, Body 1.6 x 0.8 mm; ComponentLink2URL: http://www.we-online.de/katalog/media/pdf/742792691.pdf; ComponentLink1Description: Manufacturer Link; ComponentLink2Description: Datasheet; Impedance: 1500 Ohm; PackageReference: SMD-0603; Parameter 1: *; JLCPCB Part #: *
FB9 = PAS-IND-INDUCTOR-2: SMD EMI Suppression Ferrite Bead WE-CBF, Z = 1500 Ohm; DatasheetVersion: Dec-2005; ComponentLink1URL: http://www.we-online.com; PackageVersion: 2009; PackageDescription: Chip Inductor, 2-Leads, Body 1.6 x 0.8 mm; ComponentLink2URL: http://www.we-online.de/katalog/media/pdf/742792691.pdf; ComponentLink1Description: Manufacturer Link; ComponentLink2Description: Datasheet; Impedance: 1500 Ohm; PackageReference: SMD-0603; Parameter 1: *; JLCPCB Part #: *
P1 = WE-CN-1P-M-R4: THT Angled Pin Header WR-PHD, Pitch 2.54 mm, Single Row, 4 pins; Manufacturer: Wurth Elektronik; Gender: Male; Pin Number: 4; Withstanding Voltage: 500VAC; Working Voltage: 250VAC; Contact Resistance: 20mOhm; Pitch: 2.54mm; Rated Current: 3A; Manufacturer URL: http://www.we-online.de; Mounting Technology: THT; Publisher: WurthElektronik; Operating Temperature: -40to105degC; Packaging: Bag; Row Number: Single; Package Reference: 61300411021; Part Number: 61300411021; Orientation: Angled; Datasheet URL: https://katalog.we-online.de/em/datasheet/6130xx11021.pdf; Parameter 1: *; JLCPCB Part #: *
Q3 = CMP-1258-00008-1: Dual N-Channel Trench MOSFET, 30 V, -55 to 150 degC, 8-Pin SOT1118, Reel; Manufacturer: NXP Semiconductors; PartNumber: PMDPB56XN,115; Channel Type: N; VGSth [typ] (V): 1; VDS [max] (V): 30; Coss [typ] (pF): 35; Ciss [typ] (pF): 170; PackageVersion: 13-06-06, 06/2013; Packing: Reel; DatasheetVersion: Rev. 1; ComponentLink3Description: Package Specification; PackageDescription: 6-Pin Small Outline No-Lead, Body 2 x 2 mm, Pitch 0.65 mm; PackageReference: SOT1118; ComponentLink2URL: http://www.nxp.com/documents/data_sheet/PMDPB56XN.pdf; ComponentLink2Description: Datasheet; Mounting Technology: Surface Mount; ComponentLink1Description: Manufacturer URL; ComponentLink1URL: http://www.nxp.com/; ComponentLink3URL: http://www.nxp.com/documents/outline_drawing/sot1118_po.pdf; Parameter 1: *; JLCPCB Part #: *
R38 R87 = RES: ±1% ±400ppm/℃ 5.1Ω 0.1W 0603 Chip Resistor - Surface Mount ROHS; Part Number: ERJ3EKF1803V; Manufacturer: Panasonic; Manufacturer Part Number: ERJ-3EKF1803V; Resistance: 180kR; Power Rating: 100mW; Voltage Rating: 75V; Temperature Coefficient: 100ppm/°C; Supplier 1: Digi-Key; Supplier Part Number 1: P180KHCT-ND; RoHS: Yes; Category: Chip SMD Resistors; Stock 1: 113875; Pricing 1: 1=0.10000, 10=0.06100, 100=0.02460, 1000=0.01106, 2500=0.00960 (USD); Mount: Surface Mount; Case/Package: 0603; Case Code (Metric): 1608; Case Code (Imperial): 0603; Contact Plating: Tin; Weight: 7.1E-05oz; Min Operating Temperature: -55°C; Max Operating Temperature: 155°C; Tolerance: 1%; Packaging: Tape and Reel; Resistor Type: Thick Film; Series: ERJ; Package Quantity: 1; Number of Terminations: 2; Termination: SMD/SMT; Max Power Dissipation: 100mW; Voltage Rating (DC): 75V; Construction: Rectangular; Features: Automotive AEC-Q200; Resistance Tolerance: 1%; Length: 1.6mm; Width: 0.031inch; Height: 0.022inch; Depth: 0.8mm; Radiation Hardening: No; RoHS Compliant: Yes; Military Standard: Not; Lead Free: Lead Free; REACH SVHC: No SVHC; ComponentLink1URL: https://datasheet.ciiva.com/22739/426256-22739797.pdf?src-supplier=Element14; ComponentLink1Description: https://datasheet.ciiva.com/22739/426256-22739797.pdf?src-supplier=Element14; ComponentLink2URL: https://datasheet.ciiva.com/24162/aoa0000ce2-24162661.pdf?src-supplier=Mouser; ComponentLink2Description: https://datasheet.ciiva.com/24162/aoa0000ce2-24162661.pdf?src-supplier=Mouser; ComponentLink3URL: https://datasheet.ciiva.com/30137/aoa0000ce2-30137813.pdf?src-supplier=Onlinecomponents.com; ComponentLink3Description: https://datasheet.ciiva.com/30137/aoa0000ce2-30137813.pdf?src-supplier=Onlinecomponents.com; ComponentLink4URL: https://datasheet.ciiva.com/46436/1678782-46436790.pdf?src-supplier=Element14; ComponentLink4Description: https://datasheet.ciiva.com/46436/1678782-46436790.pdf?src-supplier=Element14; ComponentLink5URL: https://datasheet.ciiva.com/46436/1678782-46436791.pdf?src-supplier=Element14; ComponentLink5Description: https://datasheet.ciiva.com/46436/1678782-46436791.pdf?src-supplier=Element14; ComponentLink6URL: https://datasheet.ciiva.com/16782/70260748-16782408.pdf?src-supplier=Allied+Electronics; ComponentLink6Description: https://datasheet.ciiva.com/16782/70260748-16782408.pdf?src-supplier=Allied+Electronics; ComponentLink7URL: https://datasheet.ciiva.com/17207/aoa0000ce2-17207208.pdf?src-supplier=Avnet+Europe; ComponentLink7Description: https://datasheet.ciiva.com/17207/aoa0000ce2-17207208.pdf?src-supplier=Avnet+Europe; ComponentLink8URL: https://datasheet.ciiva.com/28568/1678782-28568699.pdf?src-supplier=Element14; ComponentLink8Description: https://datasheet.ciiva.com/28568/1678782-28568699.pdf?src-supplier=Element14; ComponentLink9URL: https://datasheet.ciiva.com/5915/aoa0000ce2-5915294.pdf?src-supplier=Farnell; ComponentLink9Description: https://datasheet.ciiva.com/5915/aoa0000ce2-5915294.pdf?src-supplier=Farnell; ComponentLink10URL: https://datasheet.ciiva.com/9184/aoa0000ce2-9184911.pdf?src-supplier=Avnet; ComponentLink10Description: https://datasheet.ciiva.com/9184/aoa0000ce2-9184911.pdf?src-supplier=Avnet; Parameter 1: *; JLCPCB Part #: C25197
R75 R76 = CMP-1659-00008-4: ±1% ±400ppm/℃ 10Ω 0.1W 0603 Chip Resistor - Surface Mount ROHS; Manufacturer: Yageo; Manufacturer Part Number: RC0603FR-0710RL; Voltage Rating: 50 V; Temperature Coefficient: 200ppm/°C; Power Rating: 100mW; Voltage Rating (DC): 50V; PackageReference: 0603; ComponentLink3Description: Package Specification; Packaging: Tape and Reel; Max Operating Temperature: 155 degC; ComponentLink3URL: http://www.farnell.com/datasheets/443971.pdf; PackageDescription: 2-Pin Surface Mount Device, Body 1.6 x 0.8 mm; ComponentLink1URL: http://www.yageo.com/; Pins: 2; REACH SVHC: No SVHC; RoHSCompliant: true; ComponentLink2URL: http://www.yageo.com/documents/recent/PYu-RC_Group_51_RoHS_L_04.pdf; DatasheetVersion: Rev. 4, 02/2016; Mount: Surface Mount; Package Quantity: 200; Min Operating Temperature: -55 degC; Height: 0.45 mm; Mounting Technology: Surface Mount; ComponentLink1Description: Manufacturer URL; ComponentLink2Description: Datasheet; Length: 1.6 mm; Supplier 1: Digi-Key; Supplier Part Number 1: 311-10.0HRCT-ND; RoHS: Yes; Category: Chip SMD Resistors; Stock 1: 589691; Pricing 1: 1=0.10000, 10=0.04800, 100=0.01940, 1000=0.00872, 2500=0.00756 (USD); Case/Package: 0603; Number of Pins: 2; Case Code (Imperial): 0603; Case Code (Metric): 1608; Contact Plating: Tin,Matte; Size Code: 0603; Resistance: 10R; Tolerance: 1%; Resistor Type: Thick Film; Max Power Dissipation: 100mW; Number of Terminations: 2; Termination: SMD/SMT; Series: RC; Resistance Tolerance: 1%; Features: Moisture Resistant; Construction: Rectangular; Technology: THICK FILM; Width: 0.8mm; Depth: 0.8mm; Radiation Hardening: No; RoHS Compliant: Yes; Military Standard: Not; Lead Free: Lead Free; ComponentLink4URL: https://datasheet.ciiva.com/11808/0900766b80f96399-11808140.pdf?src-supplier=RSComponents; ComponentLink4Description: https://datasheet.ciiva.com/11808/0900766b80f96399-11808140.pdf?src-supplier=RSComponents; ComponentLink5URL: https://datasheet.ciiva.com/7746/443971-7746245.pdf?src-supplier=Element14; ComponentLink5Description: https://datasheet.ciiva.com/7746/443971-7746245.pdf?src-supplier=Element14; ComponentLink6URL: https://datasheet.ciiva.com/8891/pyu-rc0603-51-rohs-l-4-8891285.pdf?src-supplier=Avnet; ComponentLink6Description: https://datasheet.ciiva.com/8891/pyu-rc0603-51-rohs-l-4-8891285.pdf?src-supplier=Avnet; ComponentLink7URL: https://datasheet.ciiva.com/28386/pyu-rc0603-51-rohs-l-4-28386637.pdf?src-supplier=Avnet+Europe; ComponentLink7Description: https://datasheet.ciiva.com/28386/pyu-rc0603-51-rohs-l-4-28386637.pdf?src-supplier=Avnet+Europe; Parameter 1: *; JLCPCB Part #: C22859
R77 = RES-2: ±1% ±100ppm/℃ 10kΩ 0.1W 0603 Chip Resistor - Surface Mount ROHS; Manufacturer: Yageo; Manufacturer Part Number: RC0603JR-071ML; Power Rating: 100mW; Resistance Tolerance: ±5%; Product Range: RCSeries; Temperature Coefficient: ±100ppm/°C; Resistor Element Type: ThickFilm; Resistance: 1Mohm; SVHC: ToBeAdvised; Voltage Rating: 50V; Resistor Case Style: 0603[1608Metric]; Tolerance: 5%; MSL: MSL1-Unlimited; Package Description: 2-Pin Surface Mount Device, Body 1.6 x 0.8 mm; Datasheet Version: Rev. 7, 05/2017; Datasheet URL: http://www.yageo.com/documents/recent/PYu-RC_Group_51_RoHS_L_7.pdf; Manufacturer URL: http://www.yageo.com/; Package Reference: 0603; Automotive Qualification Standard: -; Packaging: CutTape; Mounting Technology: SurfaceMount; Supplier 1: Digi-Key; Supplier Part Number 1: 311-1.0MGRCT-ND; Stock 1: 3949362; Pricing 1: 1=0,10000, 10=0,01900, 100=0,00770, 1000=0,00347, 2500=0,00301 (USD); RoHS: Yes; Case/Package: 0603; Number of Pins: 2; Case Code (Imperial): 0603; Case Code (Metric): 1608; Contact Plating: Tin,Matte; Min Operating Temperature: -55°C; Max Operating Temperature: 155°C; Composition: Thick Film; Termination: SMD/SMT; Package Quantity: 5000; Military Standard: Not; Voltage Rating (DC): 50V; Length: 1.6mm; Height: 0.45mm; Width: 0.8mm; Depth: 0.8mm; Radiation Hardening: No; Lead Free: Lead Free; REACH SVHC: No SVHC; ComponentLink1URL: https://datasheet.ciiva.com/46395/443971-46395067.pdf?src-supplier=Element14; ComponentLink1Description: https://datasheet.ciiva.com/46395/443971-46395067.pdf?src-supplier=Element14; ComponentLink2URL: https://datasheet.ciiva.com/8883/pyu-rc0603-51-rohs-l-4-8883053.pdf?src-supplier=Avnet; ComponentLink2Description: https://datasheet.ciiva.com/8883/pyu-rc0603-51-rohs-l-4-8883053.pdf?src-supplier=Avnet; ComponentLink3URL: https://datasheet.ciiva.com/12555/rc0603-272842-12555342.pdf?src-supplier=Mouser; ComponentLink3Description: https://datasheet.ciiva.com/12555/rc0603-272842-12555342.pdf?src-supplier=Mouser; ComponentLink4URL: https://datasheet.ciiva.com/7746/443971-7746463.pdf?src-supplier=Element14; ComponentLink4Description: https://datasheet.ciiva.com/7746/443971-7746463.pdf?src-supplier=Element14; Parameter 1: *; JLCPCB Part #: C25804
R96 = CMP-2000-00847-1: RES SMD 3.3 OHM 1% 1/10W 0603; Part Number: ERJ-3RQF3R3V; Manufacturer: Panasonic; Temperature Coefficient: 200ppm/°C; Max Power Dissipation: 100mW; Supplier 1: Digi-Key; Supplier Part Number 1: P3.3AJCT-ND; Manufacturer Part Number: ERJ-3RQF3R3V; RoHS: Yes; Category: Chip SMD Resistors; Stock 1: 14; Pricing 1: 1=0.16000, 10=0.13600, 25=0.09920, 50=0.07200, 100=0.05330, 250=0.04092, 500=0.03224, 1000=0.02232 (USD); Mount: Surface Mount; Case/Package: 0603; Number of Pins: 2; Case Code (Metric): 1608; Case Code (Imperial): 0603; Contact Plating: Tin; Min Operating Temperature: -55°C; Max Operating Temperature: 125°C; Resistance: 3.3R; Tolerance: 1%; Packaging: Tape and Reel; Resistor Type: Thick Film; Series: ERJ; Package Quantity: 5000; Number of Terminations: 2; Power Rating: 100mW; Construction: Rectangular; Termination: SMD/SMT; Resistance Tolerance: 1%; Technology: THICK FILM; Length: 1.6mm; Width: 0.031inch; Height: 0.45mm; Depth: 0.8mm; Radiation Hardening: No; RoHS Compliant: Yes; Lead Free: Lead Free; Military Standard: Not; REACH SVHC: No SVHC; ComponentLink1URL: https://datasheet.ciiva.com/11818/0900766b80eefa12-11818391.pdf?src-supplier=RSComponents; ComponentLink1Description: https://datasheet.ciiva.com/11818/0900766b80eefa12-11818391.pdf?src-supplier=RSComponents; ComponentLink2URL: https://datasheet.ciiva.com/46447/391509-46447753.pdf?src-supplier=Element14; ComponentLink2Description: https://datasheet.ciiva.com/46447/391509-46447753.pdf?src-supplier=Element14; ComponentLink3URL: https://datasheet.ciiva.com/6137/391509-6137621.pdf?src-supplier=Farnell; ComponentLink3Description: https://datasheet.ciiva.com/6137/391509-6137621.pdf?src-supplier=Farnell; ComponentLink4URL: https://datasheet.ciiva.com/46447/391509-46447752.pdf?src-supplier=Element14; ComponentLink4Description: https://datasheet.ciiva.com/46447/391509-46447752.pdf?src-supplier=Element14; ComponentLink5URL: https://datasheet.ciiva.com/9196/aoa0000ce3-9196469.pdf?src-supplier=Avnet; ComponentLink5Description: https://datasheet.ciiva.com/9196/aoa0000ce3-9196469.pdf?src-supplier=Avnet; ComponentLink6URL: https://datasheet.ciiva.com/30239/6aoa0000ce3-30239769.pdf?src-supplier=Onlinecomponents.com; ComponentLink6Description: https://datasheet.ciiva.com/30239/6aoa0000ce3-30239769.pdf?src-supplier=Onlinecomponents.com; ComponentLink7URL: https://datasheet.ciiva.com/17213/aoa0000ce3-17213654.pdf?src-supplier=Avnet+Europe; ComponentLink7Description: https://datasheet.ciiva.com/17213/aoa0000ce3-17213654.pdf?src-supplier=Avnet+Europe; Parameter 1: *; JLCPCB Part #: *
R106 = RES-2: as R110 on sheet ISO_IO; Length: 7.3 mm; ComponentLink1URL: http://www.yageo.com/; Packaging: Tape and Reel; Pins: 2; ComponentLink1Description: Manufacturer URL; Case Code (Imperial): 2917; REACH SVHC: No SVHC; Width: 4.3 mm; ComponentLink2Description: Datasheet; Voltage Rating: 16 V; RoHSCompliant: True; Max Operating Temperature: 125degC; ComponentLink2URL: http://www.yageo.com/documents/recent/PYu-RC_Group_51_RoHS_L_04.pdf; Min Operating Temperature: -55degC; Case/Package: 2917; Radiation Hardening: No; DatasheetVersion: Rev. 4, 02/2016; Mount: Surface Mount; PackageReference: 0603; Package Quantity: 500; Case Code (Metric): 7343; PackageDescription: 2-Pin Surface Mount Device, Body 1.6 x 0.8 mm; Height: 3.1 mm; Supplier 1: Digi-Key; Supplier Part Number 1: 311-330HRCT-ND; RoHS: Yes; Category: Chip SMD Resistors; Stock 1: 4209654; Pricing 1: 1=0.10000, 10=0.02300, 100=0.00940, 1000=0.00421, 2500=0.00366 (USD); Number of Pins: 2; Composition: Thick Film; Resistance: 330R; Number of Terminations: 2; Max Power Dissipation: 100mW; Termination: SMD/SMT; Features: Moisture Resistant; Depth: 0.8mm; Lead Free: Lead Free; ComponentLink3URL: https://datasheet.ciiva.com/11819/0900766b80f96399-11819327.pdf?src-supplier=RSComponents; ComponentLink3Description: https://datasheet.ciiva.com/11819/0900766b80f96399-11819327.pdf?src-supplier=RSComponents; ComponentLink4URL: https://datasheet.ciiva.com/2454/pyu-r-int-thick-7-2454864.pdf?src-supplier=Digi-Key; ComponentLink4Description: https://datasheet.ciiva.com/2454/pyu-r-int-thick-7-2454864.pdf?src-supplier=Digi-Key; ComponentLink5URL: https://datasheet.ciiva.com/2454/pyu-r-int-thick-7-2454865.pdf?src-supplier=Digi-Key; ComponentLink5Description: https://datasheet.ciiva.com/2454/pyu-r-int-thick-7-2454865.pdf?src-supplier=Digi-Key; ComponentLink6URL: https://datasheet.ciiva.com/2454/pyu-r-int-thick-7-2454866.pdf?src-supplier=Digi-Key; ComponentLink6Description: https://datasheet.ciiva.com/2454/pyu-r-int-thick-7-2454866.pdf?src-supplier=Digi-Key; ComponentLink7URL: https://datasheet.ciiva.com/12555/rc0603-272842-12555334.pdf?src-supplier=Mouser; ComponentLink7Description: https://datasheet.ciiva.com/12555/rc0603-272842-12555334.pdf?src-supplier=Mouser; ComponentLink8URL: https://datasheet.ciiva.com/46440/1868787-46440904.pdf?src-supplier=Element14; ComponentLink8Description: https://datasheet.ciiva.com/46440/1868787-46440904.pdf?src-supplier=Element14; ComponentLink9URL: https://datasheet.ciiva.com/7746/443971-7746329.pdf?src-supplier=Element14; ComponentLink9Description: https://datasheet.ciiva.com/7746/443971-7746329.pdf?src-supplier=Element14; ComponentLink10URL: https://datasheet.ciiva.com/7746/443971-7746330.pdf?src-supplier=Element14; ComponentLink10Description: https://datasheet.ciiva.com/7746/443971-7746330.pdf?src-supplier=Element14; ComponentLink11URL: https://datasheet.ciiva.com/7746/1686128-7746331.pdf?src-supplier=Element14; ComponentLink11Description: https://datasheet.ciiva.com/7746/1686128-7746331.pdf?src-supplier=Element14; Parameter 1: *; JLCPCB Part #: C23138
U19 = NCP5901BMNTBG: Integrated Circuit; Manufacturer_Name: ON Semiconductor; Datasheet Link: http://www.onsemi.com/pub/Collateral/NCP5901B-D.PDF; Height: 1mm; Manufacturer_Part_Number: NCP5901BMNTBG; Mouser Part Number: 863-NCP5901BMNTBG; Mouser Price/Stock: https://www.mouser.co.uk/ProductDetail/ON-Semiconductor/NCP5901BMNTBG?qs=UikTwjRNStJje%252BaGWM%2F5BQ%3D%3D; Arrow Part Number: NCP5901BMNTBG; Arrow Price/Stock: https://www.arrow.com/en/products/ncp5901bmntbg/on-semiconductor; Parameter 1: *; JLCPCB Part #: *

## Sheet HV_BUCK_V2.SchDoc
size A; SheetNumber: 5; SheetTotal: 8
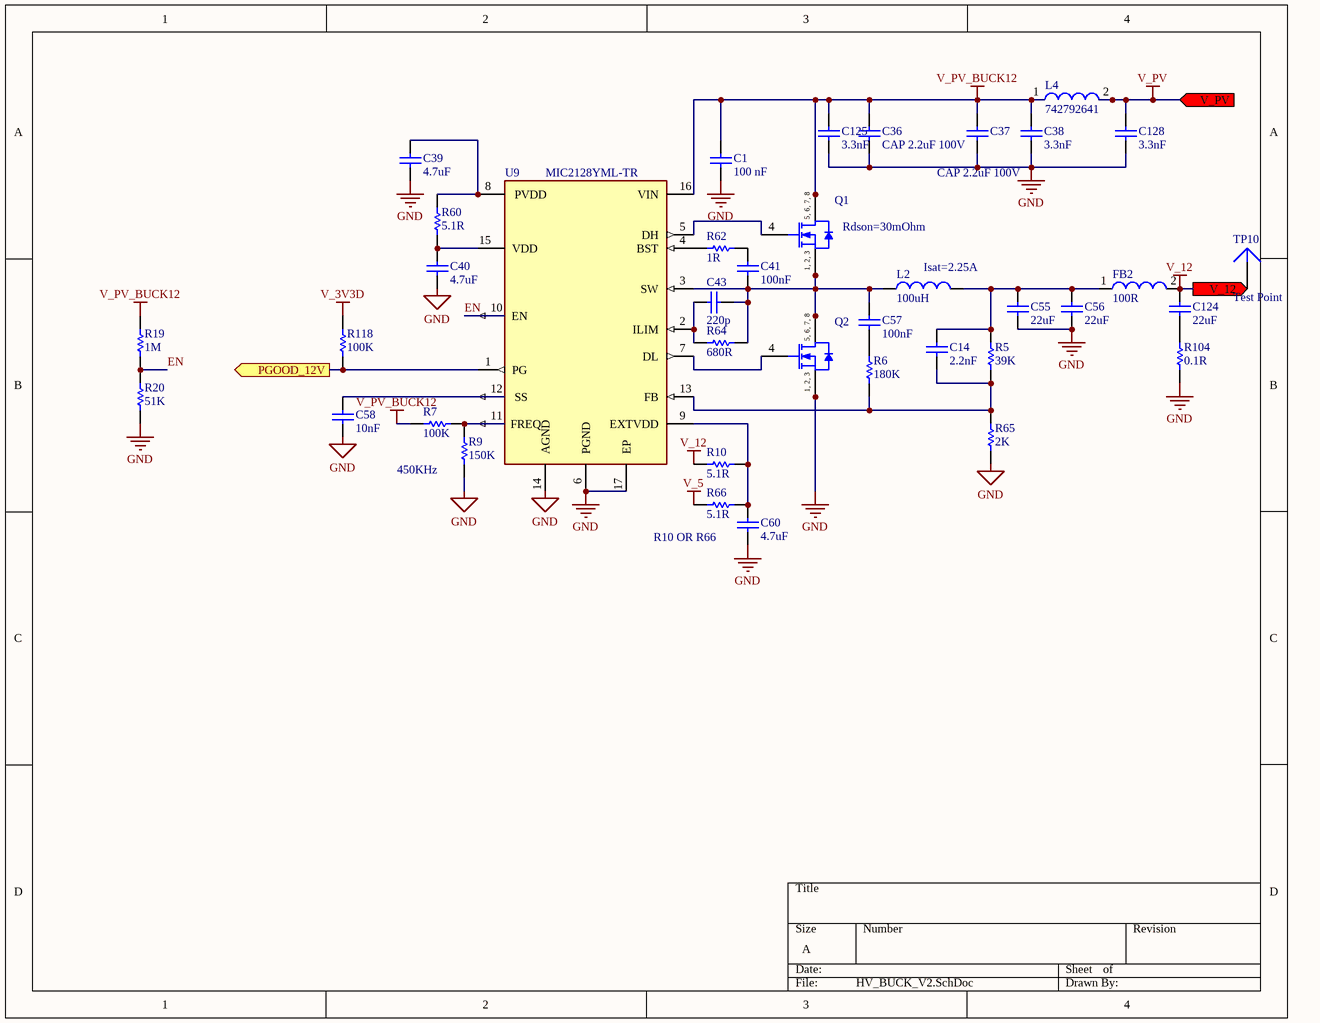
[diagram p5: HV_BUCK_V2.SchDoc]

### Parts
C1  100 nF  [CAPC2013X94X50NL20T25]
C14  2.2nF  [CAPC1005X56X25NL10T15]
C36  CAP 2.2uF 100V  [CAPC1210(3225)280_N]
C37  CAP 2.2uF 100V  [CAPC1210(3225)280_N]
C38  3.3nF  [CAPC1608X90X35LL15T15]
C39  4.7uF  [CAPC2013X135X45LL10T25]
C40  4.7uF  [CAPC2013X135X45LL10T25]
C41  100nF  [CAPC1005X56X25NL10T15]
C43  220p  [CAPC1005X56X25NL10T15]
C55  22uF  [CAPC3225X279X50NL20T25]
C56  22uF  [CAPC3225X279X50NL20T25]
C57  100nF  [CAPC1608X90X35NL10T15]
C58  10nF  [CAPC1005X56X25NL10T15]
C60  4.7uF  [CAPC2013X135X45LL10T25]
C124  22uF  [CAPC3225X279X50NL20T25]
C125  3.3nF  [CAPC1608X90X35LL15T15]
C128  3.3nF  [CAPC1608X90X35LL15T15]
FB2  100R  [SMD-0603]
L2  100uH  [VISH-IHLP4040DZER101M11_V]
L4  742792641  [RESC2012X70N]
Q1  IAUZ20N08S5L300  [INF-PG-TSDSON-8-1_V]  (value not drawn)
Q2  IAUZ20N08S5L300  [INF-PG-TSDSON-8-1_V]  (value not drawn)
R5  39K  [RESC1005X40X25NL05T10]
R6  180K  [RESC1608X55X30NL15T15]
R7  100K  [RESC1608X55X25NL10T15]
R9  150K  [RESC1608X55X25NL10T15]
R10  5.1R  [RESC1608X55X30NL15T15]
R19  1M  [RESC1608X55X25NL10T15]
R20  51K  [RESC1608X55X25NL10T15]
R60  5.1R  [RESC1608X55X30NL15T15]
R62  1R  [RESC1005X40X25NL05T10]
R64  680R  [RESC1005X40X25NL05T10]
R65  2K  [RESC1005X40X25NL05T10]
R66  5.1R  [RESC1608X55X30NL15T15]
R104  0.1R  [RESC1608X55X25ML10T15]
R118  100K  [RESC1608X55X25NL10T15]
TP10  Test Point  [TP1.5mm]
U9  MIC2128YML-TR  [QFN50P300X300X90-17N]

### Ports
PGOOD_12V (out), V_12 (out), V_PV (in)

### Nets
GND: C1.1 C36.1 C37.1 C38.1 C39.1 C40.1 C55.1 C56.1 C58.1 C60.1 C125.1 C128.1 Q2.1(SOURCE) Q2.2(SOURCE) Q2.3(SOURCE) R9.1 R20.1 R65.1 R104.1 U9.6(PGND) U9.14(AGND) U9.17(EP)
V_3V3D: R118.2
V_5: R66.2
V_12: C124.2 FB2.2 R10.2 TP10.1 ; port V_12
V_PV: C128.2 L4.2 ; port V_PV
V_PV_BUCK12: C1.2 C36.2 C37.2 C38.2 C125.2 L4.1 Q1.5(DRAIN) Q1.6(DRAIN) Q1.7(DRAIN) Q1.8(DRAIN) R7.1 R19.2 U9.16(VIN)
EN: R19.1 R20.2 U9.10(EN)
NetC14_1: C14.1 R5.1 R6.1 R65.2 U9.13(FB)
NetC14_2: C14.2 C55.2 C56.2 FB2.1 L2.2 R5.2
NetC39_2: C39.2 R60.2 U9.8(PVDD)
NetC40_2: C40.2 R60.1 U9.15(VDD)
NetC41_1: C41.1 C43.1 C57.2 L2.1 Q1.1(SOURCE) Q1.2(SOURCE) Q1.3(SOURCE) Q2.5(DRAIN) Q2.6(DRAIN) Q2.7(DRAIN) Q2.8(DRAIN) R64.1 U9.3(SW)
NetC41_2: C41.2 R62.1
NetC43_2: C43.2 R64.2 U9.2(ILIM)
NetC57_1: C57.1 R6.2
NetC58_2: C58.2 U9.12(SS)
NetC60_2: C60.2 R10.1 R66.1 U9.9(EXTVDD)
NetC124_1: C124.1 R104.2
NetQ1_4: Q1.4(GATE) U9.5(DH)
NetQ2_4: Q2.4(GATE) U9.7(DL)
NetR7_2: R7.2 R9.2 U9.11(FREQ)
NetR62_2: R62.2 U9.4(BST)
NetR118_1: R118.1 U9.1(PG) ; port PGOOD_12V

### Notes on the sheet
- (near Q1) Rdson=30mOhm
- (near L2) Isat=2.25A
- 450KHz
- R10 OR R66
- (in symbol CMP-1091-00311-1) 5, 6, 7, 8; 1, 2, 3